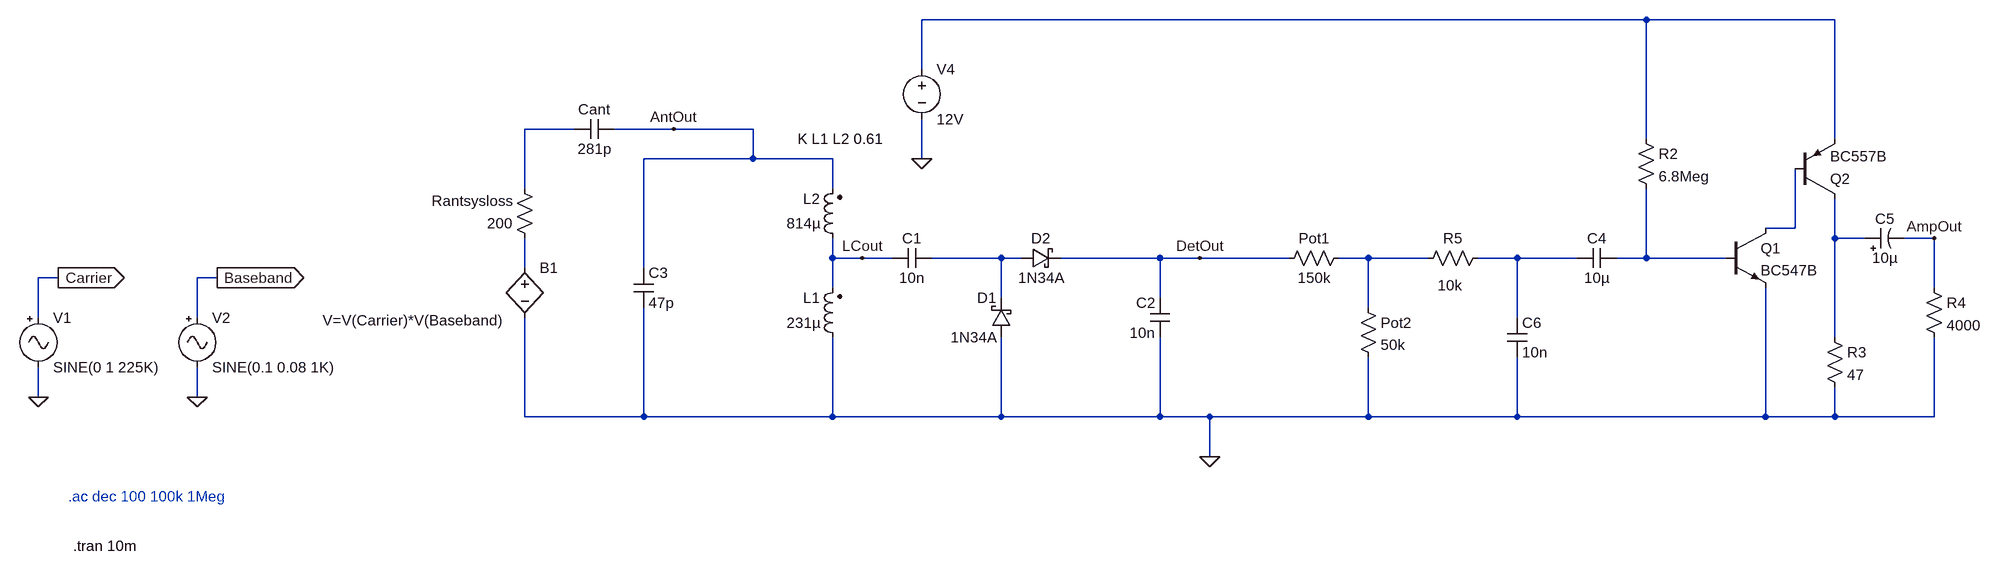
[diagram p0: schematic Detector_Radio_Complete_final.asc]
Detector_Radio_Complete_final.asc, the LTspice schematic file:
Version 4
SHEET 1 2336 680
WIRE 1280 -272 112 -272
WIRE 1584 -272 1280 -272
WIRE 112 -192 112 -272
WIRE -448 -96 -528 -96
WIRE -288 -96 -384 -96
WIRE -160 -96 -288 -96
WIRE 1280 -80 1280 -272
WIRE 1584 -80 1584 -272
WIRE -160 -48 -160 -96
WIRE -160 -48 -336 -48
WIRE -32 -48 -160 -48
WIRE 112 -48 112 -112
WIRE -528 0 -528 -96
WIRE -32 0 -32 -48
WIRE 1520 64 1520 -32
WIRE 1520 64 1472 64
WIRE 1584 80 1584 16
WIRE 1632 80 1584 80
WIRE 1744 80 1696 80
WIRE -32 112 -32 80
WIRE 16 112 -32 112
WIRE 64 112 16 112
WIRE 240 112 128 112
WIRE 272 112 240 112
WIRE 496 112 336 112
WIRE 560 112 496 112
WIRE 704 112 560 112
WIRE 832 112 784 112
WIRE 928 112 832 112
WIRE 1072 112 1008 112
WIRE 1168 112 1072 112
WIRE 1280 112 1280 0
WIRE 1280 112 1232 112
WIRE 1408 112 1280 112
WIRE -528 128 -528 80
WIRE -336 128 -336 -48
WIRE -1280 144 -1312 144
WIRE -1024 144 -1056 144
WIRE -32 160 -32 112
WIRE 1744 160 1744 80
WIRE 240 176 240 112
WIRE 496 176 496 112
WIRE 832 192 832 112
WIRE -1312 208 -1312 144
WIRE -1056 208 -1056 144
WIRE 1072 208 1072 112
WIRE 1584 240 1584 80
WIRE -1312 336 -1312 288
WIRE -1056 336 -1056 288
WIRE -528 368 -528 208
WIRE -336 368 -336 192
WIRE -336 368 -528 368
WIRE -32 368 -32 240
WIRE -32 368 -336 368
WIRE 240 368 240 240
WIRE 240 368 -32 368
WIRE 496 368 496 240
WIRE 496 368 240 368
WIRE 576 368 496 368
WIRE 832 368 832 272
WIRE 832 368 576 368
WIRE 1072 368 1072 272
WIRE 1072 368 832 368
WIRE 1472 368 1472 160
WIRE 1472 368 1072 368
WIRE 1584 368 1584 320
WIRE 1584 368 1472 368
WIRE 1744 368 1744 240
WIRE 1744 368 1584 368
WIRE 576 432 576 368
FLAG -1056 336 0
FLAG -1312 336 0
FLAG -1280 144 Carrier
IOPIN -1280 144 Out
FLAG -1024 144 Baseband
IOPIN -1024 144 Out
FLAG 576 432 0
FLAG 112 -48 0
FLAG 16 112 LCout
FLAG 560 112 DetOut
FLAG 1744 80 AmpOut
FLAG -288 -96 AntOut
SYMBOL ind2 -16 256 R180
WINDOW 0 36 80 Left 2
WINDOW 3 36 40 Left 2
SYMATTR InstName L1
SYMATTR Value 231µ
SYMATTR Type ind
SYMBOL cap -352 128 R0
SYMATTR InstName C3
SYMATTR Value 47p
SYMBOL ind2 -16 96 R180
WINDOW 0 36 80 Left 2
WINDOW 3 36 40 Left 2
SYMATTR InstName L2
SYMATTR Value 814µ
SYMATTR Type ind
SYMBOL cap 512 240 R180
WINDOW 0 24 56 Left 2
WINDOW 3 24 8 Left 2
SYMATTR InstName C2
SYMATTR Value 10n
SYMBOL schottky 256 240 R180
WINDOW 0 24 64 Left 2
WINDOW 3 24 0 Left 2
SYMATTR InstName D1
SYMATTR Value 1N34A
SYMATTR Description Diode
SYMATTR Type diode
SYMBOL schottky 272 128 R270
WINDOW 0 32 32 VTop 2
WINDOW 3 0 32 VBottom 2
SYMATTR InstName D2
SYMATTR Value 1N34A
SYMATTR Description Diode
SYMATTR Type diode
SYMBOL cap 128 96 R90
WINDOW 0 0 32 VBottom 2
WINDOW 3 32 32 VTop 2
SYMATTR InstName C1
SYMATTR Value 10n
SYMBOL Misc\\signal -1312 192 R0
WINDOW 123 0 0 Left 0
WINDOW 39 0 0 Left 0
SYMATTR InstName V1
SYMATTR Value SINE(0 1 225K)
SYMBOL Misc\\signal -1056 192 R0
WINDOW 123 0 0 Left 0
WINDOW 39 0 0 Left 0
SYMATTR InstName V2
SYMATTR Value SINE(0.1 0.08 1K)
SYMBOL bv -528 112 R0
WINDOW 3 -326 100 Left 2
SYMATTR Value V=V(Carrier)*V(Baseband)
SYMATTR InstName B1
SYMBOL res -512 96 R180
WINDOW 0 36 76 Left 2
WINDOW 3 36 40 Left 2
SYMATTR InstName Rantsysloss
SYMATTR Value 200
SYMBOL npn 1408 64 R0
SYMATTR InstName Q1
SYMATTR Value BC547B
SYMBOL pnp 1520 16 M180
SYMATTR InstName Q2
SYMATTR Value BC557B
SYMBOL res 1264 -96 R0
SYMATTR InstName R2
SYMATTR Value 6.8Meg
SYMBOL res 1568 224 R0
SYMATTR InstName R3
SYMATTR Value 47
SYMBOL voltage 112 -208 R0
WINDOW 123 0 0 Left 0
WINDOW 39 0 0 Left 0
SYMATTR InstName V4
SYMATTR Value 12V
SYMBOL cap 1232 96 R90
WINDOW 0 0 32 VBottom 2
WINDOW 3 32 32 VTop 2
SYMATTR InstName C4
SYMATTR Value 10µ
SYMBOL res 1728 144 R0
SYMATTR InstName R4
SYMATTR Value 4000
SYMBOL polcap 1632 96 R270
WINDOW 0 32 32 VTop 2
WINDOW 3 0 32 VBottom 2
SYMATTR InstName C5
SYMATTR Value 10µ
SYMATTR Description Capacitor
SYMATTR Type cap
SYMATTR SpiceLine V=16 Irms=413m Rser=0.22 Lser=0 mfg="Chemi-Con" pn="LXF16VB181M6X15LL" type="Al electrolytic"
SYMBOL res 1024 96 R90
WINDOW 0 0 56 VBottom 2
WINDOW 3 44 61 VTop 2
SYMATTR InstName R5
SYMATTR Value 10k
SYMBOL cap 1056 208 R0
SYMATTR InstName C6
SYMATTR Value 10n
SYMBOL res 816 176 R0
SYMATTR InstName Pot2
SYMATTR Value 50k
SYMBOL cap -384 -112 R90
WINDOW 0 0 32 VBottom 2
WINDOW 3 32 32 VTop 2
SYMATTR InstName Cant
SYMATTR Value 281p
SYMBOL res 800 96 R90
WINDOW 0 0 56 VBottom 2
WINDOW 3 32 56 VTop 2
SYMATTR InstName Pot1
SYMATTR Value 150k
TEXT -1264 496 Left 2 ;.ac dec 100 100k 1Meg
TEXT -1256 576 Left 2 !.tran 10m
TEXT -88 -80 Left 2 !K L1 L2 0.61

The netlist it stands for:
* Detector_Radio_Complete_final.asc
L1 0 LCout 231µ
C3 AntOut 0 47p
L2 LCout AntOut 814µ
C2 0 DetOut 10n
D1 0 N005 1N34A
D2 N005 DetOut 1N34A
C1 N005 LCout 10n
V1 Carrier 0 SINE(0 1 225K)
V2 Baseband 0 SINE(0.1 0.08 1K)
B1 N009 0 V=V(Carrier)*V(Baseband)
Rantsysloss N009 N002 200
Q1 N003 N008 0 0 BC547B
Q2 N004 N003 N001 0 BC557B
R2 N001 N008 6.8Meg
R3 N004 0 47
V4 N001 0 12V
C4 N008 N007 10µ
R4 AmpOut 0 4000
C5 N004 AmpOut 10µ V=16 Irms=413m Rser=0.22 Lser=0 mfg="Chemi-Con" pn="LXF16VB181M6X15LL" type="Al electrolytic"
R5 N007 N006 10k
C6 N007 0 10n
R§Pot2 N006 0 50k
Cant AntOut N002 281p
R§Pot1 N006 DetOut 150k
.model D D
.lib standard.dio
.model NPN NPN
.model PNP PNP
.lib standard.bjt
* .ac dec 100 100k 1Meg
.tran 10m
K L1 L2 0.61
.backanno
.end